# Altium schematic sheet FRONT_DDR.SchDoc: SDR200
size 420 x 297 mm; DocumentNumber: XXXX.468179.001 Э3; SheetNumber: 4; SheetTotal: 6; Title2str: Передняя панель; DocumentType: Схема электрическая принципиальная; Scale: 1:1
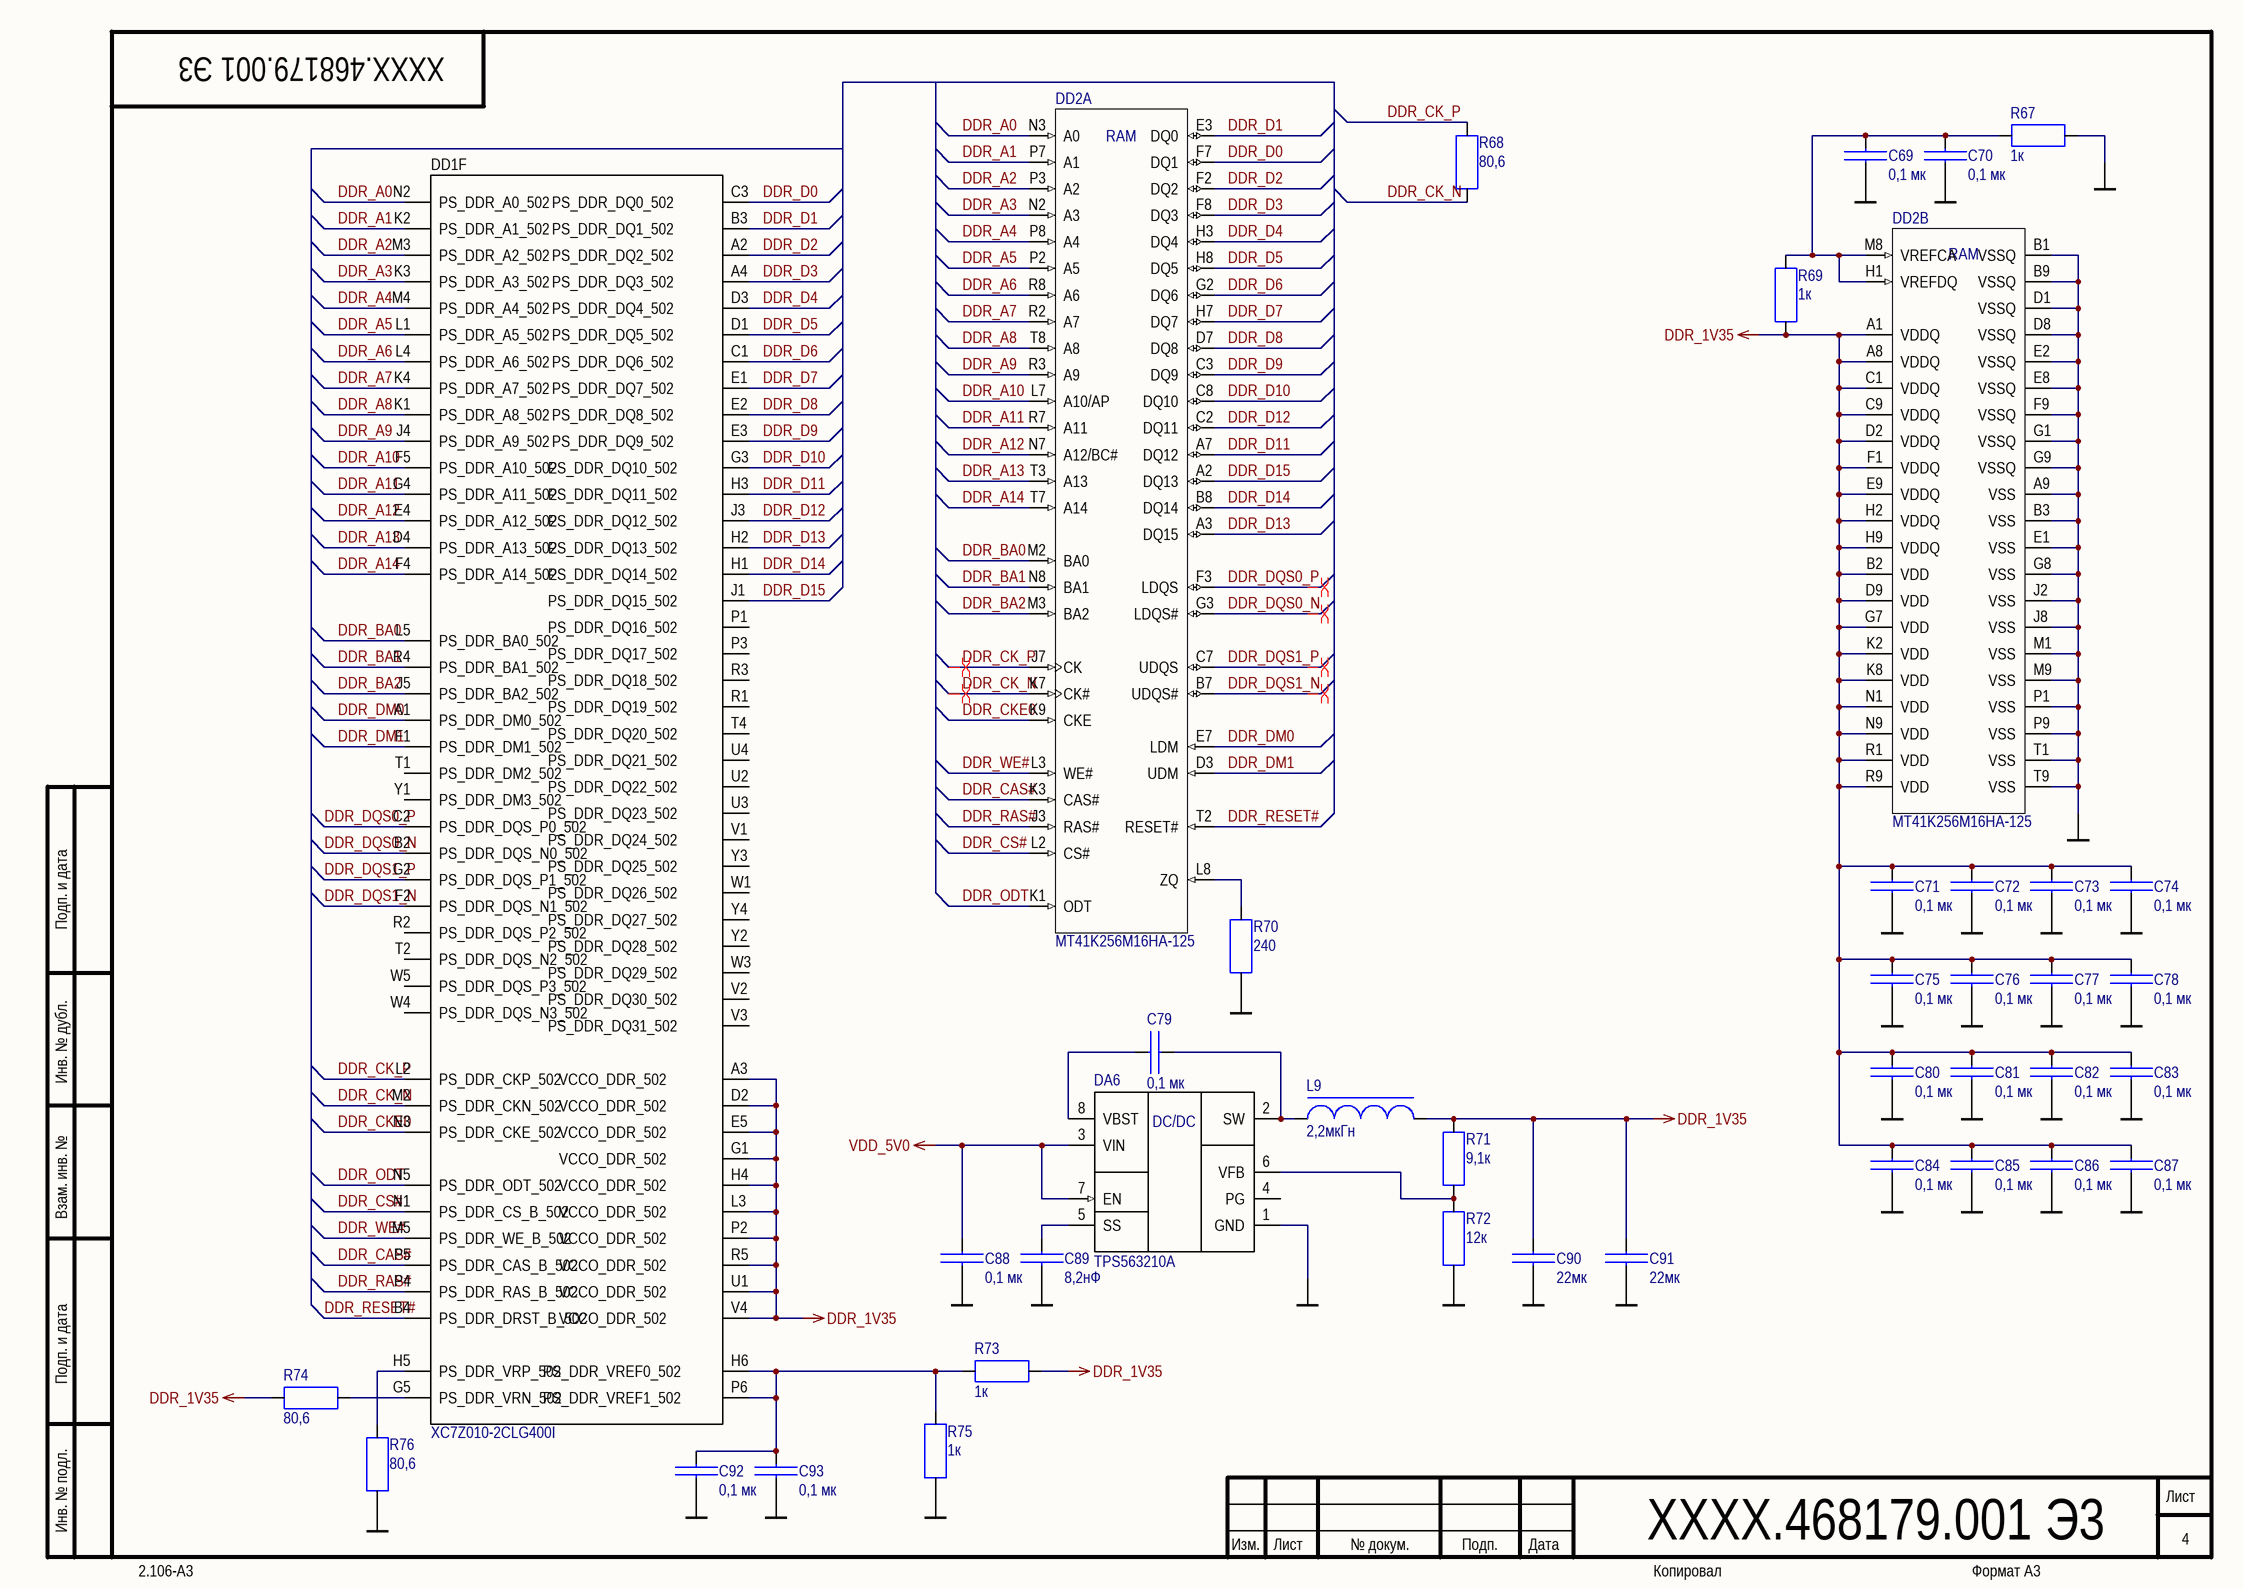
[diagram p0: FRONT_DDR.SchDoc]

## Parts
C69  Nominal: 0,1 мк  [CAPC1005X05L]  (hidden comment: CC0402KRX5R6BB104)
C70  Nominal: 0,1 мк  [CAPC1005X05L]  (hidden comment: CC0402KRX5R6BB104)
C71  Nominal: 0,1 мк  [CAPC1005X05L]  (hidden comment: CC0402KRX5R6BB104)
C72  Nominal: 0,1 мк  [CAPC1005X05L]  (hidden comment: CC0402KRX5R6BB104)
C73  Nominal: 0,1 мк  [CAPC1005X05L]  (hidden comment: CC0402KRX5R6BB104)
C74  Nominal: 0,1 мк  [CAPC1005X05L]  (hidden comment: CC0402KRX5R6BB104)
C75  Nominal: 0,1 мк  [CAPC1005X05L]  (hidden comment: CC0402KRX5R6BB104)
C76  Nominal: 0,1 мк  [CAPC1005X05L]  (hidden comment: CC0402KRX5R6BB104)
C77  Nominal: 0,1 мк  [CAPC1005X05L]  (hidden comment: CC0402KRX5R6BB104)
C78  Nominal: 0,1 мк  [CAPC1005X05L]  (hidden comment: CC0402KRX5R6BB104)
C79  Nominal: 0,1 мк  [CAPC1005X05L]  (hidden comment: CC0402KRX5R6BB104)
C80  Nominal: 0,1 мк  [CAPC1005X05L]  (hidden comment: CC0402KRX5R6BB104)
C81  Nominal: 0,1 мк  [CAPC1005X05L]  (hidden comment: CC0402KRX5R6BB104)
C82  Nominal: 0,1 мк  [CAPC1005X05L]  (hidden comment: CC0402KRX5R6BB104)
C83  Nominal: 0,1 мк  [CAPC1005X05L]  (hidden comment: CC0402KRX5R6BB104)
C84  Nominal: 0,1 мк  [CAPC1005X05L]  (hidden comment: CC0402KRX5R6BB104)
C85  Nominal: 0,1 мк  [CAPC1005X05L]  (hidden comment: CC0402KRX5R6BB104)
C86  Nominal: 0,1 мк  [CAPC1005X05L]  (hidden comment: CC0402KRX5R6BB104)
C87  Nominal: 0,1 мк  [CAPC1005X05L]  (hidden comment: CC0402KRX5R6BB104)
C88  Nominal: 0,1 мк  [CAPC1005X05L]  (hidden comment: CC0402KRX5R6BB104)
C89  Nominal: 8,2нФ  [CAPC1005X05L]  (hidden comment: CC0402KRX7R9BB822)
C90  Nominal: 22мк  [CAPC2012X09L]  (hidden comment: CC0805MKX5R5BB226)
C91  Nominal: 22мк  [CAPC2012X09L]  (hidden comment: CC0805MKX5R5BB226)
C92  Nominal: 0,1 мк  [CAPC1005X05L]  (hidden comment: CC0402KRX5R6BB104)
C93  Nominal: 0,1 мк  [CAPC1005X05L]  (hidden comment: CC0402KRX5R6BB104)
DA6  TPS563210A  [TSOP65P280X110-8L]
DD1  XC7Z010-2CLG400I  [BGA400C80P20X20_1700X1700X147]  (part F of 7)
DD2  MT41K256M16HA-125  [BGA96C80P9X16_800X1400X110]  (parts A,B of 2)
L9  Nominal: 2,2мкГн  [INDCXGL4020]  (hidden comment: XGL4020-222ME)
R67  Nominal: 1к  [RESC1005X04L]  (hidden comment: RC0402JR-071KL)
R68  Nominal: 80,6  [RESC1005X04L]  (hidden comment: RC0402FR-0780R6L)
R69  Nominal: 1к  [RESC1005X04L]  (hidden comment: RC0402JR-071KL)
R70  Nominal: 240  [RESC1005X04L]  (hidden comment: RC0402JR-07240RL)
R71  Nominal: 9,1к  [RESC1005X04L]  (hidden comment: RC0402JR-079K1L)
R72  Nominal: 12к  [RESC1005X04L]  (hidden comment: RC0402JR-0712KL)
R73  Nominal: 1к  [RESC1005X04L]  (hidden comment: RC0402JR-071KL)
R74  Nominal: 80,6  [RESC1005X04L]  (hidden comment: RC0402FR-0780R6L)
R75  Nominal: 1к  [RESC1005X04L]  (hidden comment: RC0402JR-071KL)
R76  Nominal: 80,6  [RESC1005X04L]  (hidden comment: RC0402FR-0780R6L)

## Nets
DDR_1V35: C71.2 C72.2 C73.2 C74.2 C75.2 C76.2 C77.2 C78.2 C80.2 C81.2 C82.2 C83.2 C84.2 C85.2 C86.2 C87.2 C90.2 C91.2 DD1.A3(VCCO_DDR_502) DD1.D2(VCCO_DDR_502) DD1.E5(VCCO_DDR_502) DD1.G1(VCCO_DDR_502) DD1.H4(VCCO_DDR_502) DD1.L3(VCCO_DDR_502) DD1.P2(VCCO_DDR_502) DD1.R5(VCCO_DDR_502) DD1.U1(VCCO_DDR_502) DD1.V4(VCCO_DDR_502) DD2.A1(VDDQ) DD2.A8(VDDQ) DD2.B2(VDD) DD2.C1(VDDQ) DD2.C9(VDDQ) DD2.D2(VDDQ) DD2.D9(VDD) DD2.E9(VDDQ) DD2.F1(VDDQ) DD2.G7(VDD) DD2.H2(VDDQ) DD2.H9(VDDQ) DD2.K2(VDD) DD2.K8(VDD) DD2.N1(VDD) DD2.N9(VDD) DD2.R1(VDD) DD2.R9(VDD) L9.1 R69.2 R71.1 R73.1 R74.2
GND: C69.1 C70.1 C71.1 C72.1 C73.1 C74.1 C75.1 C76.1 C77.1 C78.1 C80.1 C81.1 C82.1 C83.1 C84.1 C85.1 C86.1 C87.1 C88.1 C89.1 C90.1 C91.1 C92.1 C93.1 DA6.1(GND) DD2.A9(VSS) DD2.B1(VSSQ) DD2.B3(VSS) DD2.B9(VSSQ) DD2.D1(VSSQ) DD2.D8(VSSQ) DD2.E1(VSS) DD2.E2(VSSQ) DD2.E8(VSSQ) DD2.F9(VSSQ) DD2.G1(VSSQ) DD2.G8(VSS) DD2.G9(VSSQ) DD2.J2(VSS) DD2.J8(VSS) DD2.M1(VSS) DD2.M9(VSS) DD2.P1(VSS) DD2.P9(VSS) DD2.T1(VSS) DD2.T9(VSS) R67.2 R70.1 R72.2 R75.1 R76.1
VDD_5V0: C88.2 DA6.3(VIN) DA6.7(EN)
DDR_A0: DD1.N2(PS_DDR_A0_502) DD2.N3(A0)
DDR_A1: DD1.K2(PS_DDR_A1_502) DD2.P7(A1)
DDR_A2: DD1.M3(PS_DDR_A2_502) DD2.P3(A2)
DDR_A3: DD1.K3(PS_DDR_A3_502) DD2.N2(A3)
DDR_A4: DD1.M4(PS_DDR_A4_502) DD2.P8(A4)
DDR_A5: DD1.L1(PS_DDR_A5_502) DD2.P2(A5)
DDR_A6: DD1.L4(PS_DDR_A6_502) DD2.R8(A6)
DDR_A7: DD1.K4(PS_DDR_A7_502) DD2.R2(A7)
DDR_A8: DD1.K1(PS_DDR_A8_502) DD2.T8(A8)
DDR_A9: DD1.J4(PS_DDR_A9_502) DD2.R3(A9)
DDR_A10: DD1.F5(PS_DDR_A10_502) DD2.L7(A10/AP)
DDR_A11: DD1.G4(PS_DDR_A11_502) DD2.R7(A11)
DDR_A12: DD1.E4(PS_DDR_A12_502) DD2.N7(A12/BC#)
DDR_A13: DD1.D4(PS_DDR_A13_502) DD2.T3(A13)
DDR_A14: DD1.F4(PS_DDR_A14_502) DD2.T7(A14)
DDR_BA0: DD1.L5(PS_DDR_BA0_502) DD2.M2(BA0)
DDR_BA1: DD1.R4(PS_DDR_BA1_502) DD2.N8(BA1)
DDR_BA2: DD1.J5(PS_DDR_BA2_502) DD2.M3(BA2)
DDR_CAS#: DD1.P5(PS_DDR_CAS_B_502) DD2.K3(CAS#)
DDR_CK_N: DD1.M2(PS_DDR_CKN_502) DD2.K7(CK#) R68.1
DDR_CK_P: DD1.L2(PS_DDR_CKP_502) DD2.J7(CK) R68.2
DDR_CKE0: DD1.N3(PS_DDR_CKE_502) DD2.K9(CKE)
DDR_CS#: DD1.N1(PS_DDR_CS_B_502) DD2.L2(CS#)
DDR_D0: DD1.C3(PS_DDR_DQ0_502) DD2.F7(DQ1)
DDR_D1: DD1.B3(PS_DDR_DQ1_502) DD2.E3(DQ0)
DDR_D2: DD1.A2(PS_DDR_DQ2_502) DD2.F2(DQ2)
DDR_D3: DD1.A4(PS_DDR_DQ3_502) DD2.F8(DQ3)
DDR_D4: DD1.D3(PS_DDR_DQ4_502) DD2.H3(DQ4)
DDR_D5: DD1.D1(PS_DDR_DQ5_502) DD2.H8(DQ5)
DDR_D6: DD1.C1(PS_DDR_DQ6_502) DD2.G2(DQ6)
DDR_D7: DD1.E1(PS_DDR_DQ7_502) DD2.H7(DQ7)
DDR_D8: DD1.E2(PS_DDR_DQ8_502) DD2.D7(DQ8)
DDR_D9: DD1.E3(PS_DDR_DQ9_502) DD2.C3(DQ9)
DDR_D10: DD1.G3(PS_DDR_DQ10_502) DD2.C8(DQ10)
DDR_D11: DD1.H3(PS_DDR_DQ11_502) DD2.A7(DQ12)
DDR_D12: DD1.J3(PS_DDR_DQ12_502) DD2.C2(DQ11)
DDR_D13: DD1.H2(PS_DDR_DQ13_502) DD2.A3(DQ15)
DDR_D14: DD1.H1(PS_DDR_DQ14_502) DD2.B8(DQ14)
DDR_D15: DD1.J1(PS_DDR_DQ15_502) DD2.A2(DQ13)
DDR_DM0: DD1.A1(PS_DDR_DM0_502) DD2.E7(LDM)
DDR_DM1: DD1.F1(PS_DDR_DM1_502) DD2.D3(UDM)
DDR_DQS0_N: DD1.B2(PS_DDR_DQS_N0_502) DD2.G3(LDQS#)
DDR_DQS0_P: DD1.C2(PS_DDR_DQS_P0_502) DD2.F3(LDQS)
DDR_DQS1_N: DD1.F2(PS_DDR_DQS_N1_502) DD2.B7(UDQS#)
DDR_DQS1_P: DD1.G2(PS_DDR_DQS_P1_502) DD2.C7(UDQS)
DDR_ODT: DD1.N5(PS_DDR_ODT_502) DD2.K1(ODT)
DDR_RAS#: DD1.P4(PS_DDR_RAS_B_502) DD2.J3(RAS#)
DDR_RESET#: DD1.B4(PS_DDR_DRST_B_502) DD2.T2(RESET#)
DDR_WE#: DD1.M5(PS_DDR_WE_B_502) DD2.L3(WE#)
NetC69_2: C69.2 C70.2 DD2.H1(VREFDQ) DD2.M8(VREFCA) R67.1 R69.1
NetC79_1: C79.1 DA6.8(VBST)
NetC79_2: C79.2 DA6.2(SW) L9.2
NetC89_2: C89.2 DA6.5(SS)
NetC92_2: C92.2 C93.2 DD1.H6(PS_DDR_VREF0_502) DD1.P6(PS_DDR_VREF1_502) R73.2 R75.2
NetDA6_6: DA6.6(VFB) R71.2 R72.1
NetDD1_G5   : DD1.G5(PS_DDR_VRN_502) R74.1
NetDD1_H5   : DD1.H5(PS_DDR_VRP_502) R76.2
NetDD2_L8: DD2.L8(ZQ) R70.2

Not connected (* = marked no-connect by the designer): DA6 4(PG); DD1 P1   (PS_DDR_DQ16_502__________) P3   (PS_DDR_DQ17_502__________) R1   (PS_DDR_DQ19_502__________) R2   (PS_DDR_DQS_P2_502________) R3   (PS_DDR_DQ18_502__________) T1   (PS_DDR_DM2_502___________) T2   (PS_DDR_DQS_N2_502________) T4   (PS_DDR_DQ20_502__________) U2   (PS_DDR_DQ22_502__________) U3   (PS_DDR_DQ23_502__________) U4   (PS_DDR_DQ21_502__________) V1   (PS_DDR_DQ24_502__________) V2   (PS_DDR_DQ30_502__________) V3   (PS_DDR_DQ31_502__________) W1   (PS_DDR_DQ26_502__________) W3   (PS_DDR_DQ29_502__________) W4   (PS_DDR_DQS_N3_502________) W5   (PS_DDR_DQS_P3_502________) Y1   (PS_DDR_DM3_502___________) Y2   (PS_DDR_DQ28_502__________) Y3   (PS_DDR_DQ25_502__________) Y4   (PS_DDR_DQ27_502__________)

## Layout directives
differential pair: DDR_CK_N, DDR_CK_P, DDR_DQS0_N, DDR_DQS0_P, DDR_DQS1_N, DDR_DQS1_P

## Notes on the sheet
- Подп. и дата
- Инв. № дубл.
- Взам. инв. №
- Инв. № подл.
- Изм.
- Лист
- № докум.
- Подп.
- Дата
- 2.106-A3
- Копировал
- Формат А3
- (in symbol MT41K256M16HA-125, part A) RAM
- (in symbol MT41K256M16HA-125, part B) RAM
- (in symbol TPS563210A) DC/DC

## Library data of the parts
C69-C88 C92 C93 = CC0402KRX5R6BB104: ЧИП конденсатор; Manufacturer: Yageo; ID: 0402 0,1 мкФ 10В X7R; Tolerance: 10%; Type: X7R; Value: 0402 0,1 мкФ 10В X7R; RuNominal: 0,1 мкФ; Voltage: 10В; ManufacturerPartNumber: CC0402KRX5R6BB104; Rem: *
C89 = CC0402KRX7R9BB822: ЧИП конденсатор; Manufacturer: Yageo; ID: 0402 8,2 нФ 50В X7R; Tolerance: 10%; Type: X7R; Value: 0402 8,2 нФ 50В X7R; RuNominal: 8,2 нФ; Voltage: 50В; ManufacturerPartNumber: CC0402KRX7R9BB822; Rem: *
C90 C91 = CC0805MKX5R5BB226: ЧИП конденсатор; Manufacturer: Yageo; ID: 0805 22 мкФ 6,3В X5R; Tolerance: 0,2; Type: X5R; Value: 0805 22 мкФ 6,3В X5R; RuNominal: 22 мкФ; Voltage: 6,3В; ManufacturerPartNumber: CC0805MKX5R5BB226; Rem: *
DA6 = TPS563210A: TPS56x210A, 4.5-V to 17-V Input, 2-A, 3-A Synchrono; Manufacturer: TI; Value: TPS563210A; ComponentLink1Description: datasheet; ComponentLink1URL: https://www.ti.com/lit/ds/symlink/tps563210a.pdf?ts=1769179342855&ref_url=https%253A%252F%252Fwww.ti.com%252Fproduct%252FTPS563210A; ManufacturerPartNumber: TPS563210A; Rem: *
DD1 = XC7Z010-2CLG400I: Zynq®-7000 SoC Family; Manufacturer: Xilinx; ManufacturerPartNumber: XC7Z010-2CLG400I; Value: XC7Z010-2CLG400I
DD2 = MT41K256M16HA-125: 4Gb, x16, 1.35V DDR3L; Manufacturer: Micron; ManufacturerPartNumber: MT41K256M16HA-125; Value: MT41K256M16HA-125
L9 = XGL4020-222ME: Shielded Power Inductors; Manufacturer: Coilcraft; ID: XGL4020 2,2мкГн; Value: XGL4020 2,2мкГн; Current: 2,7А; DC Res: 19,5mOhms; ManufacturerPartNumber: XGL4020-222ME
R67 R69 R73 R75 = RC0402JR-071KL: ЧИП резистор; Manufacturer: Yageo; ID: 0402 1 кОм 5%; Tolerance: 5%; Value: 0402 1 кОм 5%; ManufacturerPartNumber: RC0402JR-071KL; Rem: *; Type: *
R68 R74 R76 = RC0402FR-0780R6L: ЧИП резистор; Manufacturer: Yageo; ID: 0402 80,6 Ом 1%; Tolerance: 1%; Value: 0402 80,6 Ом 1%; ManufacturerPartNumber: RC0402FR-0780R6L; Rem: *; Type: *
R70 = RC0402JR-07240RL: ЧИП резистор; Manufacturer: Yageo; ID: 0402 240 Ом 5%; Tolerance: 5%; Value: 0402 240 Ом 5%; ManufacturerPartNumber: RC0402JR-07240RL; Rem: *; Type: *
R71 = RC0402JR-079K1L: ЧИП резистор; Manufacturer: Yageo; ID: 0402 9,1 кОм 5%; Tolerance: 5%; Value: 0402 9,1 кОм 5%; ManufacturerPartNumber: RC0402JR-079K1L; Rem: *; Type: *
R72 = RC0402JR-0712KL: ЧИП резистор; Manufacturer: Yageo; ID: 0402 12 кОм 5%; Tolerance: 5%; Value: 0402 12 кОм 5%; ManufacturerPartNumber: RC0402JR-0712KL; Rem: *; Type: *